# EAGLE design vogelschuss-1 (EAGLE 4.15)
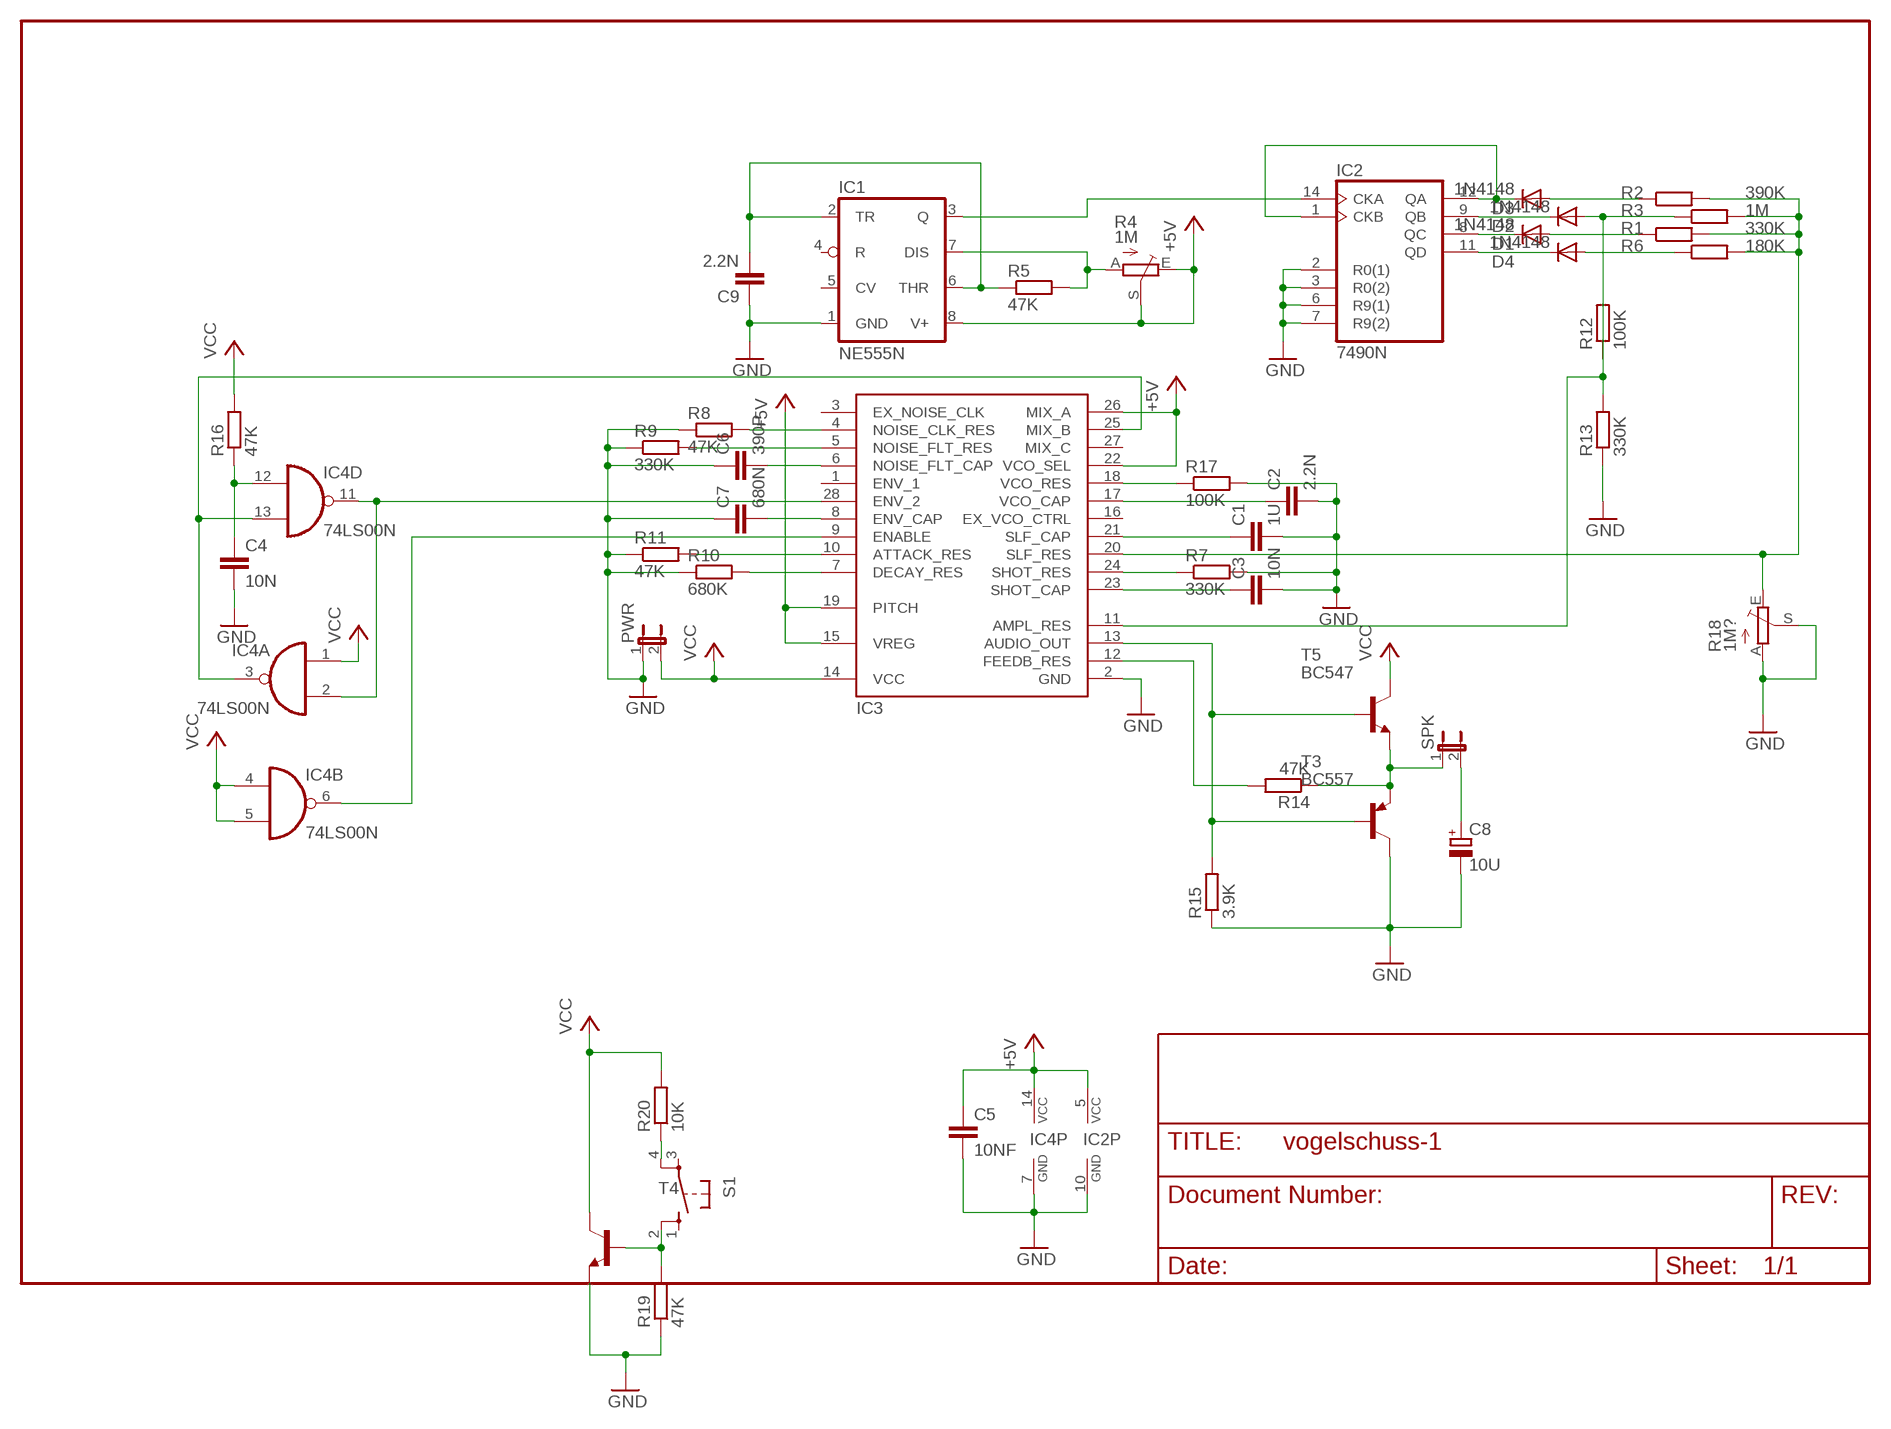
[diagram p0: schematic, sheet 1]

## Parts
C1  1U  C-EU025-025X050  [C025-025X050]
C2  2.2N  C-EU025-025X050  [C025-025X050]
C3  10N  C-EU025-025X050  [C025-025X050]
C4  10N  C-EU025-025X050  [C025-025X050]
C5  10NF  C-EU025-025X050  [C025-025X050]
C6  390P  C-EU025-025X050  [C025-025X050]
C7  680N  C-EU025-025X050  [C025-025X050]
C8  10U  CPOL-EUE2,5-6E  [E2,5-6E]
C9  2.2N  C-EU025-025X050  [C025-025X050]
D1  1N4148  [DO35-10]
D2  1N4148  [DO35-10]
D3  1N4148  [DO35-10]
D4  1N4148  [DO35-10]
IC1  NE555N  [DIL08]
IC2  7490N  [DIL14]
IC3  SN76477  [DIL28-6]
IC4  74LS00N  [DIL14]
PWR  JP1E  [JP1]
R1  330K  R-EU_0207/2V  [0207/2V]
R2  390K  R-EU_0207/2V  [0207/2V]
R3  1M  R-EU_0207/2V  [0207/2V]
R4  1M  TRIM_EU-PT10  [PT-10]
R5  47K  R-EU_0207/2V  [0207/2V]
R6  180K  R-EU_0207/2V  [0207/2V]
R7  330K  R-EU_0207/2V  [0207/2V]
R8  47K  R-EU_0207/2V  [0207/2V]
R9  330K  R-EU_0207/2V  [0207/2V]
R10  680K  R-EU_0207/2V  [0207/2V]
R11  47K  R-EU_0207/2V  [0207/2V]
R12  100K  R-EU_0207/2V  [0207/2V]
R13  330K  R-EU_0207/2V  [0207/2V]
R14  47K  R-EU_0207/2V  [0207/2V]
R15  3.9K  R-EU_0207/2V  [0207/2V]
R16  47K  R-EU_0207/2V  [0207/2V]
R17  100K  R-EU_0207/2V  [0207/2V]
R18  1M?  TRIM_EU-RJ6  [RJ6]
R19  47K  R-EU_0207/2V  [0207/2V]
R20  10K  R-EU_0207/2V  [0207/2V]
S1  10XX  [B3F-10XX]
SPK  JP1E  [JP1]
T3  BC557  BC557B-PNP-TO92-EBC  [TO92-EBC]
T4  -NPN-TO92L  [TO92L]
T5  BC547  BC547B-NPN-TO92-EBC  [TO92-EBC]

## Nets
+5V: C5.1 IC1.8(V+) IC2.5(VCC) IC3.15(VREG) IC3.19(PITCH) IC3.22(VCO_SEL) IC3.26(MIX_A) IC4.14(P:VCC) R4.E R4.S
GND: C1.2 C2.2 C3.2 C4.2 C5.2 C6.1 C7.1 C8.- C9.1 IC1.1(GND) IC2.2(R0(1)) IC2.3(R0(2)) IC2.6(R9(1)) IC2.7(R9(2)) IC2.10(GND) IC3.2(GND) IC4.7(P:GND) PWR.1 R7.2 R8.1 R9.1 R10.1 R11.1 R13.1 R15.1 R17.2 R18.A R18.S R19.1 T3.C T4.1(E)
N$1: C8.+ SPK.2
N$2: IC1.7(DIS) R4.A R5.2
N$3: C9.2 IC1.2(TR) IC1.6(THR) R5.1
N$4: IC1.3(Q) IC2.14(CKA)
N$5: D3.C IC2.1(CKB) IC2.12(QA)
N$6: D2.C IC2.9(QB)
N$7: D1.C IC2.8(QC)
N$8: D4.C IC2.11(QD)
N$9: D2.A R3.1 R12.1
N$10: D3.A R2.1
N$11: D1.A R1.1
N$12: D4.A R6.1
N$13: IC3.20(SLF_RES) R1.2 R2.2 R3.2 R6.2 R18.E
N$14: IC3.4(NOISE_CLK_RES) R8.2
N$15: R14.1 SPK.1 T3.E T5.E
N$16: IC3.18(VCO_RES) R17.1
N$17: IC3.13(AUDIO_OUT) R15.2 T3.B T5.B
N$18: IC3.12(FEEDB_RES) R14.2
N$19: IC3.11(AMPL_RES) R12.2 R13.2
N$20: C2.1 IC3.17(VCO_CAP)
N$21: C1.1 IC3.21(SLF_CAP)
N$22: IC3.5(NOISE_FLT_RES) R9.2
N$23: IC3.24(SHOT_RES) R7.1
N$24: C3.1 IC3.23(SHOT_CAP)
N$25: IC3.10(ATTACK_RES) R11.2
N$26: IC3.7(DECAY_RES) R10.2
N$27: IC3.28(ENV_2) IC4.2(A:I1) IC4.11(D:O)
N$28: C6.2 IC3.6(NOISE_FLT_CAP)
N$29: C7.2 IC3.8(ENV_CAP)
N$30: IC3.25(MIX_B) IC4.3(A:O) IC4.13(D:I1)
N$31: C4.1 IC4.12(D:I0) R16.1
N$32: IC3.9(ENABLE) IC4.6(B:O)
N$33: R19.2 S1.2 T4.2(B)
N$34: R20.1 S1.4
VCC: IC3.14(VCC) IC4.1(A:I0) IC4.4(B:I0) IC4.5(B:I1) PWR.2 R16.2 R20.2 T4.3(C) T5.C
Unconnected: IC1.4(R) IC1.5(CV) IC3.1(ENV_1) IC3.3(EX_NOISE_CLK) IC3.16(EX_VCO_CTRL) IC3.27(MIX_C) IC4.8(C:O) IC4.9(C:I0) IC4.10(C:I1) S1.1 S1.3

## Library data of the parts
C1-C7 C9 = rcl:C-EU: CAPACITOR, European symbol
C8 = rcl:CPOL-EU: POLARIZED CAPACITOR, European symbol
D1-D4 = diode:1N4148: DIODE high speed (Philips)
IC1 = linear:*555: TIMER
IC2 = 74xx-eu:74*90: Decade, divide by twelve and binary COUNTER
IC3 = turbod3:SN76477
IC4 = 74xx-eu:74*00: Quad 2-input NAND gate
PWR SPK = jumper:JP1E: JUMPER
R1-R3 R5-R17 R19 R20 = rcl:R-EU_: RESISTOR, European symbol
R4 R18 = pot:TRIM_EU-: POTENTIOMETER
S1 = KEY_B:10XX
T3 = transistor:*-PNP-: PNP Transistror
T4 T5 = transistor:*-NPN-: NPN Transistror

## Net classes
0 default: width 0.5 mm

## Board
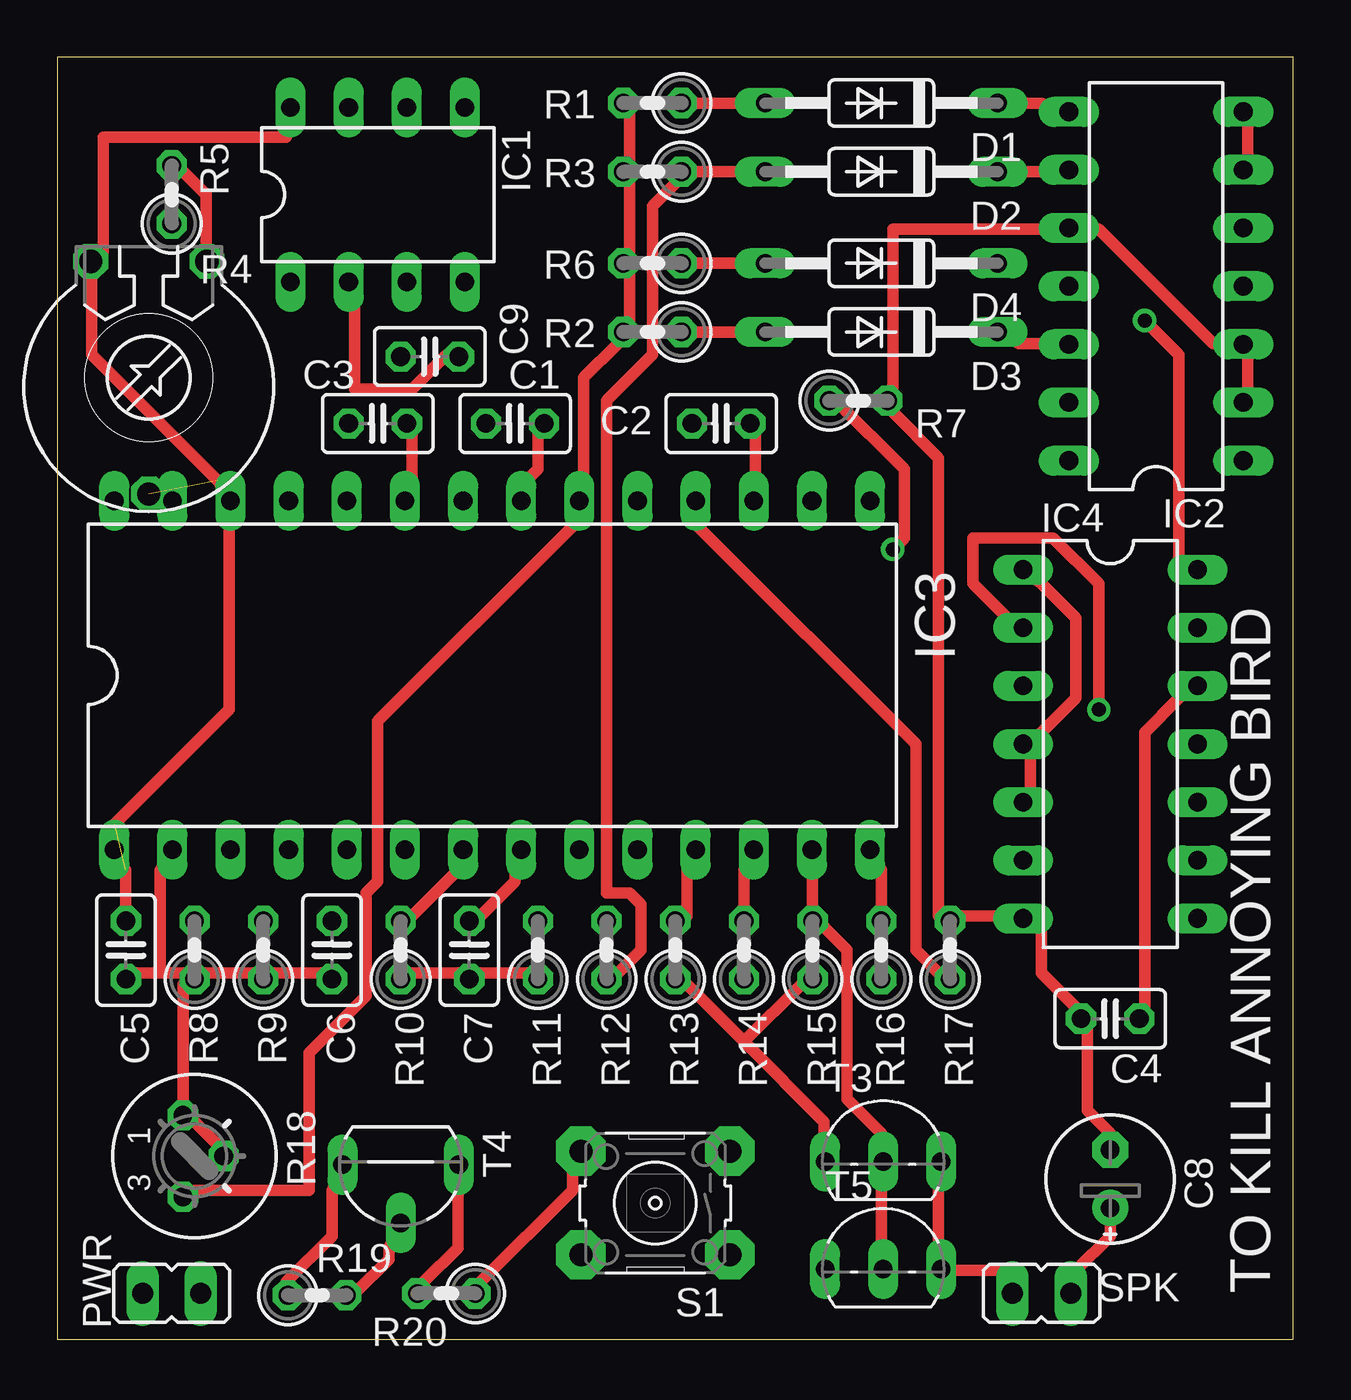
[diagram p1: board, top side]
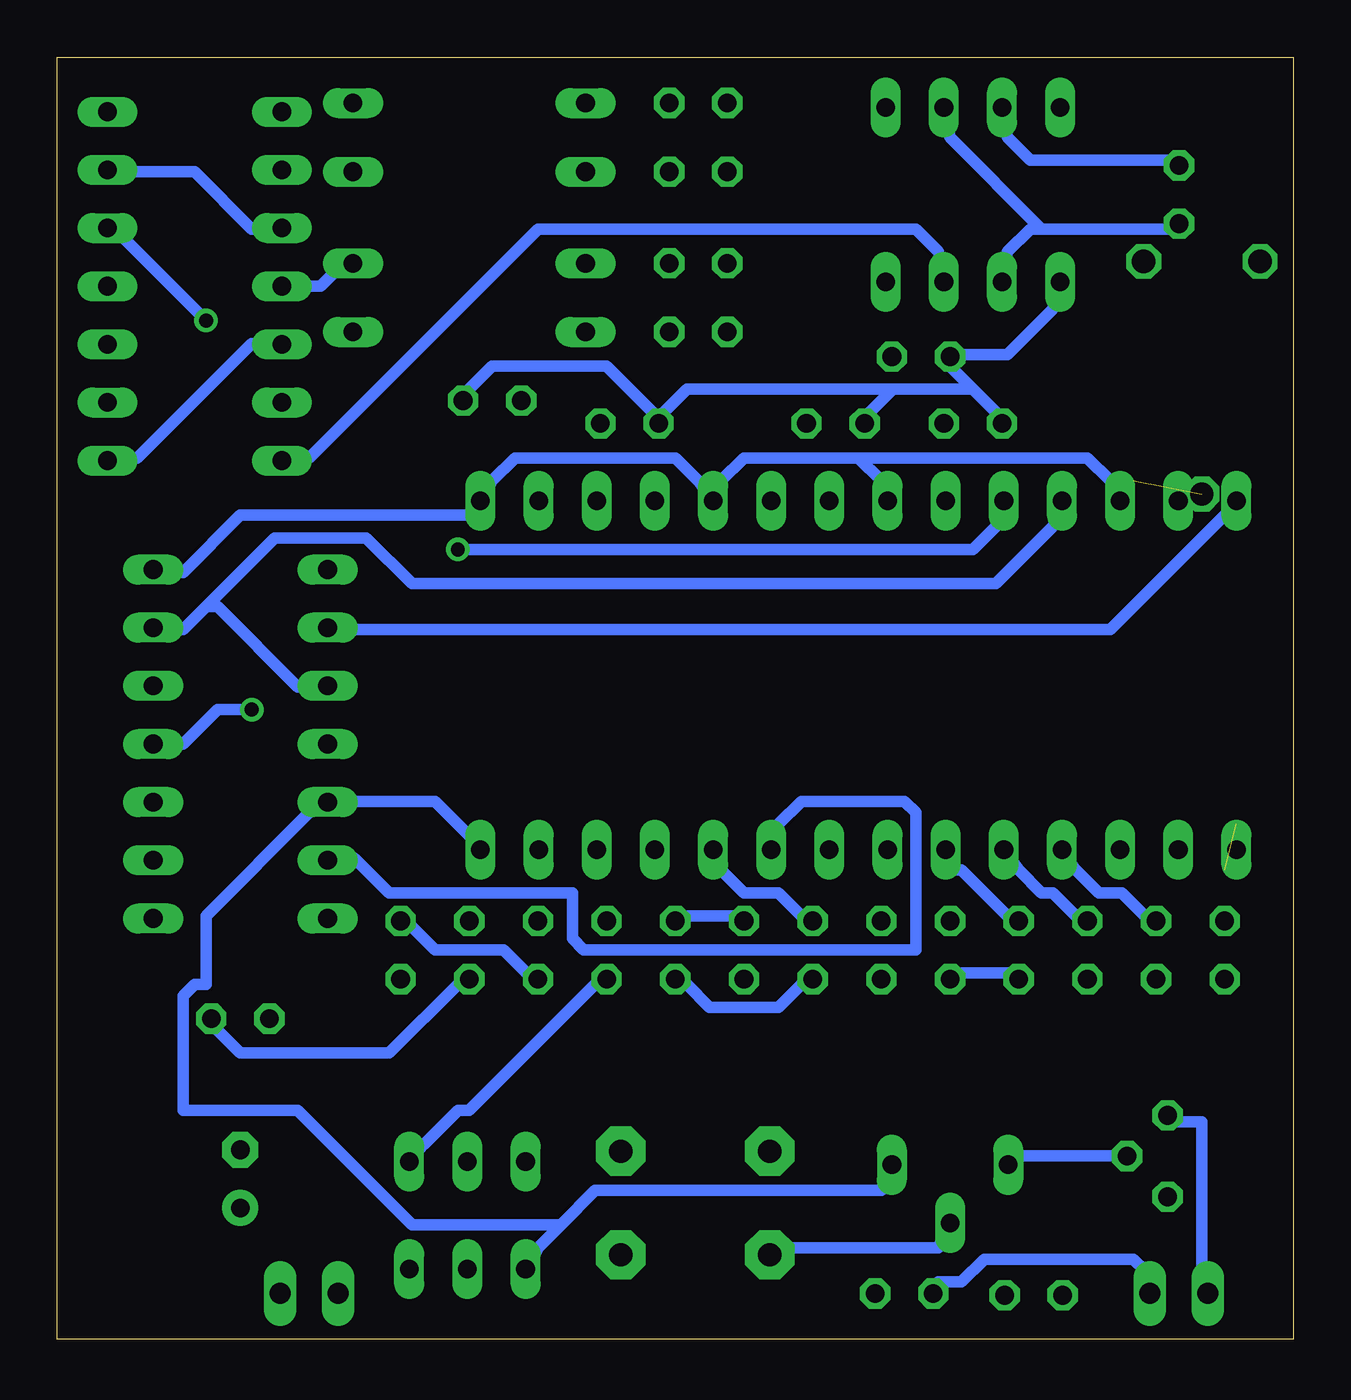
[diagram p2: board, bottom side, seen from below]

Size 54 x 56 mm. Coordinates in mm from the lower left corner, seen from the top.
Outline: 0,0 54,0 54,56 0,56 0,0
Copper layers (1*16): Top 0.035mm / dielectric 1.5mm / Bottom 0.035mm
Design rules "olimex": minimum track width 10mil, minimum drill 24mil, track to track 10mil, track to pad 10mil, pad to pad 10mil, via to via 10mil, smd to smd 10mil, copper to edge 40mil, drill to drill 10mil, minimum pad ring 10mil, minimum via ring 8mil, stop-mask expansion 0mil, vias tented up to drill 0mil, thermal gap 10mil

### Footprints (pad centres in the part's own frame; a part is rotated, then mirrored left to right if it is on the bottom)
C025-025X050 = drill 0.813 octagon: 1 -1.27,0; 2 1.27,0
E2,5-6E = drill 0.813 pad 1.575 round: + -1.27,0 | drill 0.813 pad 1.575 octagon: - 1.27,0
DO35-10 = drill 0.813 long: A 5.08,0; C -5.08,0
DIL08 = drill 0.813 long: 1 -3.81,-3.81; 2 -1.27,-3.81; 3 1.27,-3.81; 4 3.81,-3.81; 5 3.81,3.81; 6 1.27,3.81; 7 -1.27,3.81; 8 -3.81,3.81
DIL14 = drill 0.813 long: 1 -7.62,-3.81; 2 -5.08,-3.81; 3 -2.54,-3.81; 4 0,-3.81; 5 2.54,-3.81; 6 5.08,-3.81; 7 7.62,-3.81; 8 7.62,3.81; 9 5.08,3.81; 10 2.54,3.81; 11 0,3.81; 12 -2.54,3.81; 13 -5.08,3.81; 14 -7.62,3.81
DIL28-6 = drill 0.813 long: 1 -16.51,-7.62; 2 -13.97,-7.62; 3 -11.43,-7.62; 4 -8.89,-7.62; 5 -6.35,-7.62; 6 -3.81,-7.62; 7 -1.27,-7.62; 8 1.27,-7.62; 9 3.81,-7.62; 10 6.35,-7.62; 11 8.89,-7.62; 12 11.43,-7.62; 13 13.97,-7.62; 14 16.51,-7.62; 15 16.51,7.62; 16 13.97,7.62; 17 11.43,7.62; 18 8.89,7.62; 19 6.35,7.62; 20 3.81,7.62; 21 1.27,7.62; 22 -1.27,7.62; 23 -3.81,7.62; 24 -6.35,7.62; 25 -8.89,7.62; 26 -11.43,7.62; 27 -13.97,7.62; 28 -16.51,7.62
JP1 = drill 0.914 long: 1 0,-1.27; 2 0,1.27
0207/2V = drill 0.813 octagon: 1 -1.27,0; 2 1.27,0
PT-10 = drill 1.016 octagon: A -2.54,-5.08; E 2.54,-5.08; S 0,5.08
RJ6 = drill 0.813 octagon: A -1.778,-0.508; E 1.778,-0.508; S 0,1.27
B3F-10XX = drill 1.016 pad 2.159 octagon: 1 -3.379,2.312; 2 3.123,2.312; 3 -3.379,-2.209; 4 3.123,-2.209
TO92-EBC = drill 0.813 long: B 0,-1.27; C -2.54,-1.27; E 2.54,-1.27
TO92L = drill 0.813 long: 1 0,-2.54; 2 2.54,0; 3 0,2.54

### Placement (x,y rotation side)
C1  20,40 180 top
C2  29,40 180 top
C3  14,40 180 top
C4  46,14 180 top
C5  3,17 270 top
C6  12,17 90 top
C7  18,17 90 top
C8  46,7 90 top
C9  16.27,42.92 0 top
D1  36,54 180 top
D2  36,51 180 top
D3  36,44 180 top
D4  36,47 180 top
IC1  14,50 0 top
IC2  48,46 90 top
IC3  19,29 0 top
IC4  46,26 270 top
PWR  5,2 270 top
R1  26,54 180 top
R2  26,44 180 top
R3  26,51 180 top
R4  4,42 180 top
R5  5,50 90 top
R6  26,47 180 top
R7  35,41 0 top
R8  6,17 90 top
R9  9,17 90 top
R10  15,17 90 top
R11  21,17 90 top
R12  24,17 90 top
R13  27,17 90 top
R14  30,17 90 top
R15  33,17 90 top
R16  36,17 90 top
R17  39,17 90 top
R18  6,8 270 top
R19  11.35,1.92 0 top
R20  17,2 180 top
S1  26,6 180 top
SPK  43,2 270 top
T3  36.08,9.03 0 top
T4  15,7.62 270 top
T5  36.08,4.33 0 top

### Tracks (layer width: path | path; a pad name or v marks a point on that pad's centre or on a via)
+5V  (via drill 0.61)  (2 unrouted)
  Top 0.5: C5.1 3,20.5 | IC1.8 10,52.5 2,52.5 2,47.5 R4.E 1.5,46.5 1.5,43 7,37.5 IC3.26 7.5,35.5 7.5,27.5 2.5,22.5 | v47.5,44.5 49,43 49,34 IC4.14
  Bottom 0.5: 19,38.5 18,37.5 IC3.22 | 19,38.5 24,38.5 25,37.5 IC3.19 26,37.5 27,38.5 34,38.5 35,37.5 IC3.15 36,36 46,36 48.5,33.5 IC4.14 | v47.5,44.5 51,48 IC2.5 | 19,38.5 9,38.5 8,37.5 IC3.26
GND
  Top 0.5: IC2.2 52,41.5 52,43 IC2.3 50.5,43.5 45.5,48.5 IC2.10 43,48.5 36.5,48.5 36.5,41.5 R7.2 36.5,40.5 38.5,38.5 38.5,18.5 R17.2 39.5,18.5 41,18.5 IC4.7 43,18 43,16 44.5,14.5 C4.2 45,13.5 45,10 46,9 C8.- | IC2.7 52,53 52,51.5 IC2.6 | R19.1 10,2.5 12,4.5 12,6.5 T4.1 | R18.S 7,8.5 6,9.5 R18.A 5.5,10 5.5,15.5 R8.1 | 30,13 33.5,9.5 33.5,9 T3.C | 30,13 27.5,15.5 R13.1 | 30,13 32.5,15.5 R15.1 | R10.1 15.5,16 17.5,16 C7.1 18.5,16 20.5,16 R11.1 | C6.1 11.5,16 9.5,16 R9.1 8.5,16 6.5,16 R8.1 | 4.5,16 5.5,16 R8.1 | 4.5,16 3.5,16 C5.2 | 4.5,16 4.5,20.5 IC3.2
  Bottom 0.5: IC2.10 45.5,48.5 48,51 50.5,51 IC2.6 | 14,41.5 15,42.5 C9.1 14.5,43 12.5,43 10.5,45 IC1.1 | 14,41.5 13,40.5 C3.2 | 17.5,41.5 18.5,40.5 C1.2 | 17.5,41.5 14,41.5 | 17.5,41.5 26.5,41.5 27.5,40.5 C2.2 28,40.5 30,42.5 35,42.5 36,41.5 R7.2 | PWR.1 4,3 4,9.5 5,9.5 R18.A | T4.1 12,8 R18.S | R10.1 14.5,16 12.5,16 C6.1 | R13.1 26.5,15.5 25.5,14.5 22.5,14.5 21.5,15.5 R11.1 | R17.2 38.5,18 37.5,17 34.5,17 33.5,16 R15.1
N$1
  Top 0.5: SPK.2 44.5,3 46,4.5 C8.+
N$2
  Top 0.5: R5.2 5.5,51 6.5,50 6.5,47.5 R4.A
  Bottom 0.5: IC1.7 12.5,52.5 11.5,51.5 5.5,51.5 R5.2
N$3
  Top 0.5: C9.2 17,43 15.5,41.5 13,41.5 13,45 IC1.2
  Bottom 0.5: 11,48.5 11.5,48.5 12.5,47.5 IC1.2 | 11,48.5 5.5,48.5 R5.1 | 11,48.5 15,52.5 IC1.6
N$4
  Bottom 0.5: IC1.3 15.5,47.5 16.5,48.5 33,48.5 43,38.5 IC2.14
N$5
  Top 0.5: D3.C 42,43.5 43,43.5 IC2.12
  Bottom 0.5: IC2.1 50.5,38.5 45.5,43.5 IC2.12
N$6
  Top 0.5: D2.C 43,51 IC2.9
N$7
  Top 0.5: D1.C 43,54 IC2.8
N$8
  Bottom 0.5: D4.C 42,46.5 42.5,46 IC2.11
N$9
  Top 0.5: R12.1 24.5,16 25.5,17 25.5,19 25,19.5 24,19.5 24,41 26,43 26,49.5 27,50.5 R3.1 D2.A
N$10
  Top 0.5: R2.1 D3.A
N$11
  Top 0.5: R1.1 D1.A
N$12
  Top 0.5: R6.1 D4.A
N$13
  Top 0.5: R1.2 25,53.5 25,51.5 R3.2 25,50.5 25,47.5 R6.2 25,46.5 25,44.5 R2.2 24.5,43.5 23,42 23,37.5 IC3.20 22.5,35.5 14,27 14,20 13.5,19.5 13.5,15 11,12.5 11,6.5 6,6.5 R18.E
N$14
  Bottom 0.5: R8.2 6.5,18.5 7.5,19.5 8.5,19.5 9.5,20.5 IC3.4
N$15
  Top 0.5: SPK.1 41.5,3 39,3 T5.E 38.5,4 38.5,6.5 T3.E
  Bottom 0.5: R14.1 30.5,15.5 36,10 36.5,10 38,8.5 T3.E
N$16
  Top 0.5: R17.1 38.5,16 37.5,17 37.5,26 28,35.5 IC3.18
N$17
  Top 0.5: IC3.13 33,20.5 R15.2 33.5,18 34.5,17 34.5,10.5 36,9 T3.B 36,6.5 36,4 T5.B
N$18
  Top 0.5: R14.2 30,20.5 IC3.12
N$19
  Top 0.5: IC3.11 27.5,20.5 27.5,18.5 R13.2
  Bottom 0.5: R12.2 24.5,18.5 26.5,18.5 R13.2
N$20
  Top 0.5: C2.1 30.5,39.5 30.5,37.5 IC3.17
N$21
  Top 0.5: IC3.21 20.5,37.5 21,38 21,39.5 C1.1
N$22
  Bottom 0.5: R9.2 9.5,18.5 10.5,19.5 11,19.5 12,20.5 IC3.5
N$23  (via drill 0.61)
  Top 0.5: v36.5,34.5 37,35 37,38 34,41 R7.1
  Bottom 0.5: v36.5,34.5 14,34.5 13,35.5 IC3.24
N$24
  Top 0.5: IC3.23 15.5,37.5 15.5,39.5 C3.1
N$25
  Bottom 0.5: R11.2 21.5,18.5 22.5,19.5 24,19.5 25,20.5 IC3.10
N$26
  Top 0.5: R10.2 15.5,18.5 17.5,20.5 IC3.7
N$27  (via drill 0.61)
  Top 0.5: v45.5,27.5 45.5,33 43.5,35 40,35 40,33 41.5,31.5 IC4.2
  Bottom 0.5: IC3.28 3,36 8,31 41,31 IC4.2 | v45.5,27.5 47,27.5 48.5,26 IC4.11
N$28
  Bottom 0.5: C6.2 12.5,18.5 14.5,20.5 15,20.5 IC3.6
N$29
  Top 0.5: C7.2 18.5,18.5 20,20 20,20.5 IC3.8
N$30
  Bottom 0.5: 47.5,32 48.5,31 IC4.13 | 47.5,32 44.5,35 40.5,35 38.5,33 13,33 10.5,35.5 IC3.25 | 47.5,32 47,32 43.5,28.5 IC4.3
N$31
  Top 0.5: IC4.12 49,28 47.5,26.5 47.5,14.5 C4.1
  Bottom 0.5: R16.1 36.5,15.5 39.5,12.5 46,12.5 47,13.5 C4.1
N$32
  Bottom 0.5: IC3.9 22.5,22.5 21.5,23.5 17,23.5 16.5,23 16.5,17 31,17 31.5,17.5 31.5,19.5 39.5,19.5 41,21 IC4.6
N$33
  Top 0.5: R19.2 13,2 14.5,3.5 14.5,4 T4.2
  Bottom 0.5: S1.2 22,4 15.5,4 T4.2
N$34
  Top 0.5: R20.1 18.5,2.5 22.5,6.5 22.5,7.5 S1.4
VCC
  Top 0.5: R16.2 36,20.5 IC3.14 | IC4.5 42.5,24 42.5,25.5 IC4.4 43,26.5 44.5,28 44.5,31.5 43,33 IC4.1 | R20.2 16,2.5 17.5,4 17.5,6.5 T4.3
  Bottom 0.5: IC3.14 36,22 37.5,23.5 41,23.5 IC4.5 43,23 47.5,18.5 47.5,15.5 48,15.5 48.5,15 48.5,10 43.5,10 38.5,5 32,5 | 32,5 30.5,6.5 18,6.5 T4.3 | 32,5 33,4 T5.C | PWR.2 6.5,3 7,3.5 13.5,3.5 14.5,2.5 15.5,2.5 R20.2

### Text on the board
tNames: TO KILL ANNOYING BIRD